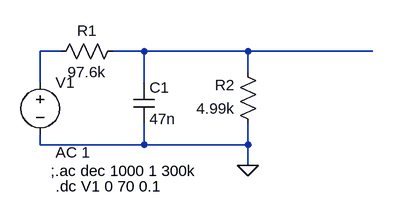
[diagram p0: schematic Motor Voltage Feedback.asc]
Motor Voltage Feedback.asc, the LTspice schematic file:
Version 4
SHEET 1 880 680
WIRE 80 80 48 80
WIRE 208 80 160 80
WIRE 368 80 208 80
WIRE 560 80 368 80
WIRE 368 112 368 80
WIRE 48 128 48 80
WIRE 208 128 208 80
WIRE 48 224 48 208
WIRE 208 224 208 192
WIRE 208 224 48 224
WIRE 368 224 368 192
WIRE 368 224 208 224
WIRE 368 256 368 224
FLAG 368 256 0
SYMBOL res 176 64 R90
WINDOW 0 0 56 VBottom 2
WINDOW 3 32 56 VTop 2
SYMATTR InstName R1
SYMATTR Value 97.6k
SYMBOL res 384 208 R180
WINDOW 0 36 76 Left 2
WINDOW 3 36 40 Left 2
SYMATTR InstName R2
SYMATTR Value 4.99k
SYMATTR SpiceLine tol=1
SYMBOL cap 192 128 R0
SYMATTR InstName C1
SYMATTR Value 47n
SYMBOL voltage 48 112 R0
WINDOW 123 24 124 Left 2
WINDOW 39 0 0 Left 0
SYMATTR InstName V1
SYMATTR Value ""
SYMATTR Value2 AC 1
TEXT 64 264 Left 2 !;.ac dec 1000 1 300k
TEXT 72 288 Left 2 !.dc V1 0 70 0.1

The netlist it stands for:
* Motor Voltage Feedback.asc
R1 N002 N001 97.6k
R2 0 N002 4.99k tol=1
C1 N002 0 47n
V1 N001 0 AC 1
;.ac dec 1000 1 300k
.dc V1 0 70 0.1
.backanno
.end